# Altium schematic sheet RGB_ARRAY.SchDoc
size A; SheetNumber: 1; SheetTotal: 1
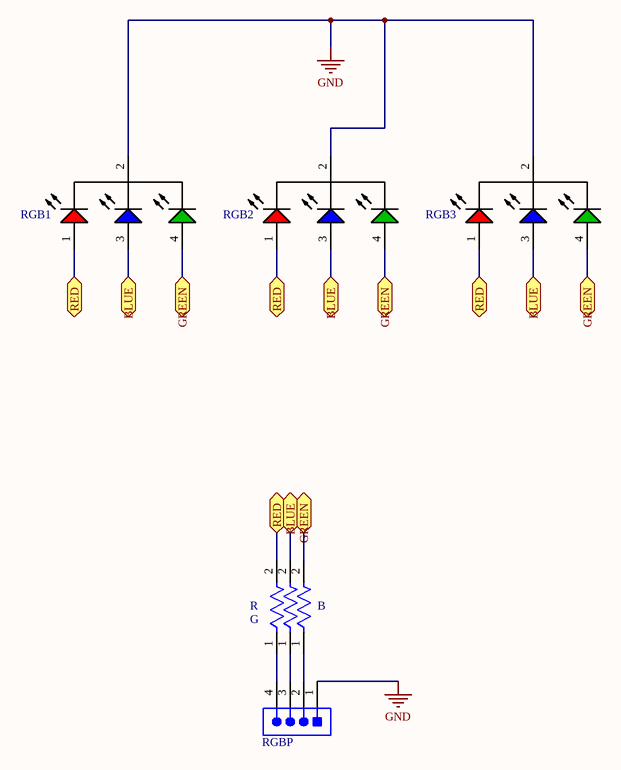
[diagram p0: RGB_ARRAY.SchDoc]

## Parts
B  RNC55H1002FSB14  [FP-RNC55-MFG]  (value not drawn)
G  RNC55H1002FSB14  [FP-RNC55-MFG]  (value not drawn)
R  RNC55H1002FSB14  [FP-RNC55-MFG]  (value not drawn)
RGB1  WP154A4SUREQBFZGC  [KING-WP154A4SUREQBFZGC_V]  (value not drawn)
RGB2  WP154A4SUREQBFZGC  [KING-WP154A4SUREQBFZGC_V]  (value not drawn)
RGB3  WP154A4SUREQBFZGC  [KING-WP154A4SUREQBFZGC_V]  (value not drawn)
RGBP  GRPB041VWVN-RC  [SLIN-GRPB041VWVN-RC_V]  (value not drawn)

## Ports
BLUE (bidir), GREEN (bidir), RED (bidir)

## Nets
GND: RGB1.2(CATHODE) RGB2.2(CATHODE) RGB3.2(CATHODE) RGBP.1
BLUE: G.2 RGB1.3(BLUE) RGB2.3(BLUE) RGB3.3(BLUE) ; port BLUE
GREEN: B.2 RGB1.4(GREEN) RGB2.4(GREEN) RGB3.4(GREEN) ; port GREEN
RED: R.2 RGB1.1(RED) RGB2.1(RED) RGB3.1(RED) ; port RED
NetB_1: B.1 RGBP.2
NetG_1: G.1 RGBP.3
NetR_1: R.1 RGBP.4

## Library data of the parts
B G = CMP-02408-000004-1: RES 10K OHM 1/8W 1% AXIAL; Manufacturer: Vishay; Voltage Rating: 200V; Power Rating: 0.125W; Resistance: 100Ω; Temperature Coefficient: 50ppm/°C; Value: 100Ω; Automotive: No; Category: Res; Tolerance: 1%; Temperature: -65°C to +175°C; Device Class L2: Resistors; Composition: Metal Film; Height: 2.69mm; Failure Rate: 0.001%; ComponentLink2URL: https://www.vishay.com/docs/31025/erc.pdf; Manufacturer Part Number: RNC55H1002FSB14; Temperature Range High: +175°C; Lead Free: No; Series: RNC; Device Class L1: Passive Components; Ipc Land Pattern Name: RESAD1100W85L762D269; Octopart: https://octopart.com/rnc55h1002fs-vishay-40848808; Package: RNC55; RoHS: FALSE; Military Standard: true; Device Class L3: Through-Hole Resistors; ComponentLink2Description: Datasheet; Digikey Description: RES 10K OHM 1/8W 1% AXIAL; Temperature Range Low: -65°C
R = CMP-02408-000004-1: RES 10K OHM 1/8W 1% AXIAL; Manufacturer: Vishay; Voltage Rating: 200V; Power Rating: 0.125W; Resistance: 180Ω; Temperature Coefficient: 50ppm/°C; Value: 180Ω; Automotive: No; Category: Res; Tolerance: 1%; Temperature: -65°C to +175°C; Device Class L2: Resistors; Composition: Metal Film; Height: 2.69mm; Failure Rate: 0.001%; ComponentLink2URL: https://www.vishay.com/docs/31025/erc.pdf; Manufacturer Part Number: RNC55H1002FSB14; Temperature Range High: +175°C; Lead Free: No; Series: RNC; Device Class L1: Passive Components; Ipc Land Pattern Name: RESAD1100W85L762D269; Octopart: https://octopart.com/rnc55h1002fs-vishay-40848808; Package: RNC55; RoHS: FALSE; Military Standard: true; Device Class L3: Through-Hole Resistors; ComponentLink2Description: Datasheet; Digikey Description: RES 10K OHM 1/8W 1% AXIAL; Temperature Range Low: -65°C
RGB1-RGB3 = CMP-2000-07415-1: Full Color LED Lamp, Dominant Wavelength RGB 630 / 525 / 465 nm, -40 to 85 degC, 4-Pin THD, RoHS; Manufacturer: Kingbright; Viewing Angle: 50°; Wavelength - Dominant: 630nm,525nm,465nm; Online Catalog: 5mm,T-13/4(RGB)RoundwithDomedTopLEDLamp; Millicandela Rating: 1300mcdRed,1700mcdGreen,900mcdBlue; Other Names: 754-1615 / WP154A4SUREQBFZGC-ND; Current - Test: 20mA; Wavelength - Peak: 645nm,515nm,460nm; Voltage - Forward (Vf) (Typ): 1.9VRed,3.3VGreen,3.3VBlue; Lens Type: Clear; 3D Model: WP154A4SUREQBFZGW.sldprt / WP154A4SUREQBFZGW.pro / WP154A4SUREQBFZGW.igs / WP154A4SUREQBFZGW.stp; Lens Style/Size: RoundwithDomedTop,5mm,T-13/4; Packaging: Bulk; Datasheet URL: https://www.kingbrightusa.com/images/catalog/spec/WP154A4SUREQBFZGC.pdf; Family: LEDIndication-Discrete; Color: Red,Green,Blue(RGB); Datasheet Version: Rev. 5A, 08/2014; Category: Optoelectronics; Manufacturer URL: http://www.kingbright.com/; Height: 8.60mm; Mounting Type: ThroughHole; Package Reference: WP154A4SUREQBFZGC; Mounting Technology: ThroughHole; Package Description: 4-Pin Through Hole LED, Dia 5.9 mm, Pitch 1.27 mm; Standard Package: 500; Package / Case: Radial-4Leads
RGBP = CMP-2000-06373-1: Male Header, Pitch 1.27 mm, 1 x 4 Position, Height 4 mm, Tail Length 2.3 mm, -40 to 105 degC, RoHS, Bulk; Manufacturer: Sullins; Mating Products: S9010E-04-ND / -CONNHEADER.050"4POSR/APCB / S9008E-04-ND / -CONNHEADER.050"4POSPCBGOLD / S9005E-04-ND / -CONNHEADER.050"4POSSMDGOLD; Other Names: S9014E-04; Dynamic Catalog: GRPB; Pitch: 0.050"(1.27mm); Number of Positions Loaded: All; Number of Positions: 4; Catalog Drawings: S9014ESeriesTop; Connector Type: Header,Unshrouded; Contact Finish Thickness: Flash; Number of Rows: 1; Contact Type: MalePin; Category: Connectors,Interconnects; Contact Mating Length: 0.118"(3.00mm); Family: RectangularConnectors-Headers,MalePins; Datasheet Version: Rev. C, 12/2008; Contact Finish: Gold; Termination: Solder; Manufacturer URL: http://www.sullinscorp.com/; Mounting Type: ThroughHole; Packaging: Bulk; Package Reference: GRPB041VWVN-RC; Datasheet URL: http://www.sullinscorp.com/drawings/71_GRPB___1VWVN-RC,_10957-C.pdf; Mounting Technology: ThroughHole; Package Description: Male Header, Pitch 1.27 mm, 1 x 4 Position, Height 4 mm, Tail Length 2.3 mm; Standard Package: 1